# Altium schematic sheet [8] CONNECTORS MECH.SchDoc
size 431 x 279 mm; SheetNumber: 9; SheetTotal: 9
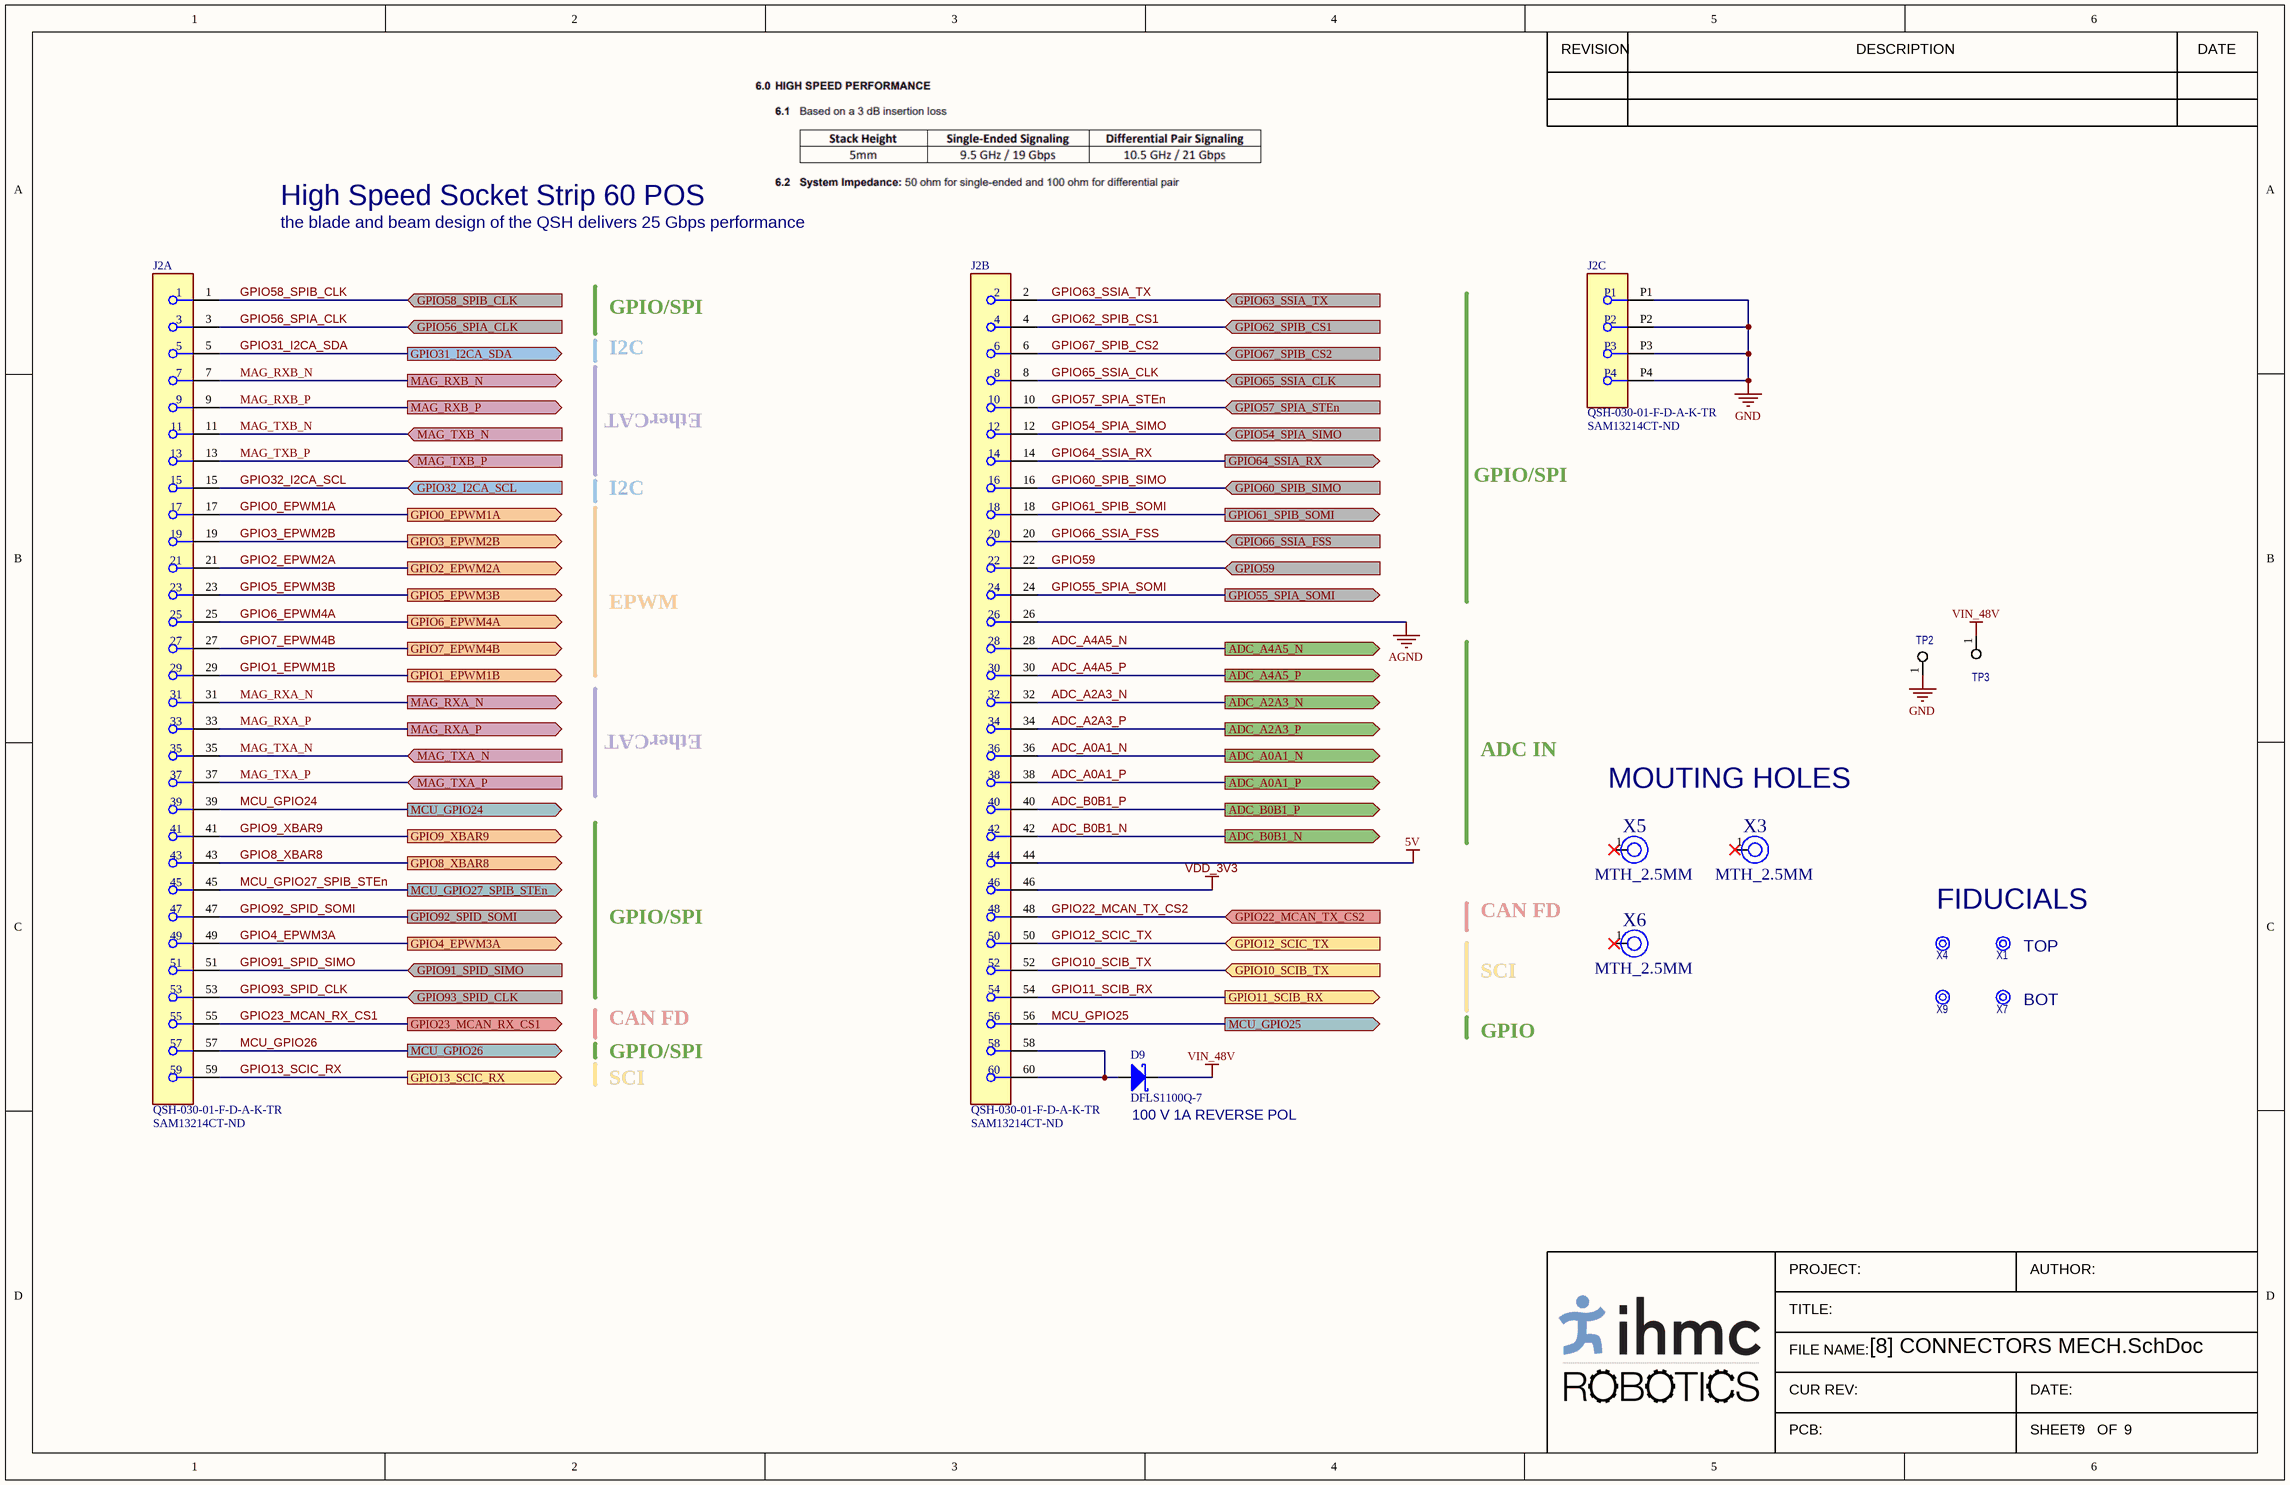
[diagram p0: [8] CONNECTORS MECH.SchDoc]

## Parts
D9  DFLS1100Q-7  [DI_123]
J2  QSH-030-01-F-D-A-K-TR  Supplier Part Number 1: SAM13214CT-ND  [FP-QSH-030-01-F-D-A-K-TR-MFG]  (parts A,B,C of 3)
TP2  TP_SMD  [TP_5019]  (value not drawn)  (no BOM)
TP3  TP_SMD  [TP_5019]  (value not drawn)  (no BOM)
X1  FIDUCIAL  [FIDUCIAL]  (value not drawn)  (no BOM)
X3  MTH_2.5MM  [MTH-M2.5mm]  (no BOM)
X4  FIDUCIAL  [FIDUCIAL]  (value not drawn)  (no BOM)
X5  MTH_2.5MM  [MTH-M2.5mm]  (no BOM)
X6  MTH_2.5MM  [MTH-M2.5mm]  (no BOM)
X7  FIDUCIAL  [FIDUCIAL]  (value not drawn)  (no BOM)
X9  FIDUCIAL  [FIDUCIAL]  (value not drawn)  (no BOM)

## Ports
ADC_A0A1_N (out), ADC_A0A1_P (out), ADC_A2A3_N (out), ADC_A2A3_P (out), ADC_A4A5_N (out), ADC_A4A5_P (out), ADC_B0B1_N (out), ADC_B0B1_P (out), GPIO0_EPWM1A (out), GPIO1_EPWM1B (out), GPIO2_EPWM2A (out), GPIO3_EPWM2B (out), GPIO4_EPWM3A (out), GPIO5_EPWM3B (out), GPIO6_EPWM4A (out), GPIO7_EPWM4B (out), GPIO8_XBAR8 (out), GPIO9_XBAR9 (out), GPIO10_SCIB_TX (in), GPIO11_SCIB_RX (out), GPIO12_SCIC_TX (in), GPIO13_SCIC_RX (out), GPIO22_MCAN_TX_CS2 (in), GPIO23_MCAN_RX_CS1 (out), GPIO31_I2CA_SDA (out), GPIO32_I2CA_SCL (in), GPIO54_SPIA_SIMO (in), GPIO55_SPIA_SOMI (out), GPIO56_SPIA_CLK (in), GPIO57_SPIA_STEn (in), GPIO58_SPIB_CLK (in), GPIO59 (in), GPIO60_SPIB_SIMO (in), GPIO61_SPIB_SOMI (out), GPIO62_SPIB_CS1 (in), GPIO63_SSIA_TX (in), GPIO64_SSIA_RX (out), GPIO65_SSIA_CLK (in), GPIO66_SSIA_FSS (in), GPIO67_SPIB_CS2 (in), GPIO91_SPID_SIMO (in), GPIO92_SPID_SOMI (out), GPIO93_SPID_CLK (in), MAG_RXA_N (out), MAG_RXA_P (out), MAG_RXB_N (out), MAG_RXB_P (out), MAG_TXA_N (in), MAG_TXA_P (in), MAG_TXB_N (in), MAG_TXB_P (in), MCU_GPIO24 (out), MCU_GPIO25 (out), MCU_GPIO26 (out), MCU_GPIO27_SPIB_STEn (out)

## Nets
5V: J2.44
AGND: J2.26
GND: J2.P1 J2.P2 J2.P3 J2.P4 TP2.1(IN)
VDD_3V3: J2.46
VIN_48V: D9.1(K) TP3.1(IN)
ADC_A0A1_N: J2.36 ; port ADC_A0A1_N
ADC_A0A1_P: J2.38 ; port ADC_A0A1_P
ADC_A2A3_N: J2.32 ; port ADC_A2A3_N
ADC_A2A3_P: J2.34 ; port ADC_A2A3_P
ADC_A4A5_N: J2.28 ; port ADC_A4A5_N
ADC_A4A5_P: J2.30 ; port ADC_A4A5_P
ADC_B0B1_N: J2.42 ; port ADC_B0B1_N
ADC_B0B1_P: J2.40 ; port ADC_B0B1_P
GPIO0_EPWM1A: J2.17 ; port GPIO0_EPWM1A
GPIO1_EPWM1B: J2.29 ; port GPIO1_EPWM1B
GPIO2_EPWM2A: J2.21 ; port GPIO2_EPWM2A
GPIO3_EPWM2B: J2.19 ; port GPIO3_EPWM2B
GPIO4_EPWM3A: J2.49 ; port GPIO4_EPWM3A
GPIO5_EPWM3B: J2.23 ; port GPIO5_EPWM3B
GPIO6_EPWM4A: J2.25 ; port GPIO6_EPWM4A
GPIO7_EPWM4B: J2.27 ; port GPIO7_EPWM4B
GPIO8_XBAR8: J2.43 ; port GPIO8_XBAR8
GPIO9_XBAR9: J2.41 ; port GPIO9_XBAR9
GPIO10_SCIB_TX: J2.52 ; port GPIO10_SCIB_TX
GPIO11_SCIB_RX: J2.54 ; port GPIO11_SCIB_RX
GPIO12_SCIC_TX: J2.50 ; port GPIO12_SCIC_TX
GPIO13_SCIC_RX: J2.59 ; port GPIO13_SCIC_RX
GPIO22_MCAN_TX_CS2: J2.48 ; port GPIO22_MCAN_TX_CS2
GPIO23_MCAN_RX_CS1: J2.55 ; port GPIO23_MCAN_RX_CS1
GPIO31_I2CA_SDA: J2.5 ; port GPIO31_I2CA_SDA
GPIO32_I2CA_SCL: J2.15 ; port GPIO32_I2CA_SCL
GPIO54_SPIA_SIMO: J2.12 ; port GPIO54_SPIA_SIMO
GPIO55_SPIA_SOMI: J2.24 ; port GPIO55_SPIA_SOMI
GPIO56_SPIA_CLK: J2.3 ; port GPIO56_SPIA_CLK
GPIO57_SPIA_STEn: J2.10 ; port GPIO57_SPIA_STEn
GPIO58_SPIB_CLK: J2.1 ; port GPIO58_SPIB_CLK
GPIO59: J2.22 ; port GPIO59
GPIO60_SPIB_SIMO: J2.16 ; port GPIO60_SPIB_SIMO
GPIO61_SPIB_SOMI: J2.18 ; port GPIO61_SPIB_SOMI
GPIO62_SPIB_CS1: J2.4 ; port GPIO62_SPIB_CS1
GPIO63_SSIA_TX: J2.2 ; port GPIO63_SSIA_TX
GPIO64_SSIA_RX: J2.14 ; port GPIO64_SSIA_RX
GPIO65_SSIA_CLK: J2.8 ; port GPIO65_SSIA_CLK
GPIO66_SSIA_FSS: J2.20 ; port GPIO66_SSIA_FSS
GPIO67_SPIB_CS2: J2.6 ; port GPIO67_SPIB_CS2
GPIO91_SPID_SIMO: J2.51 ; port GPIO91_SPID_SIMO
GPIO92_SPID_SOMI: J2.47 ; port GPIO92_SPID_SOMI
GPIO93_SPID_CLK: J2.53 ; port GPIO93_SPID_CLK
MAG_RXA_N: J2.31 ; port MAG_RXA_N
MAG_RXA_P: J2.33 ; port MAG_RXA_P
MAG_RXB_N: J2.7 ; port MAG_RXB_N
MAG_RXB_P: J2.9 ; port MAG_RXB_P
MAG_TXA_N: J2.35 ; port MAG_TXA_N
MAG_TXA_P: J2.37 ; port MAG_TXA_P
MAG_TXB_N: J2.11 ; port MAG_TXB_N
MAG_TXB_P: J2.13 ; port MAG_TXB_P
MCU_GPIO24: J2.39 ; port MCU_GPIO24
MCU_GPIO25: J2.56 ; port MCU_GPIO25
MCU_GPIO26: J2.57 ; port MCU_GPIO26
MCU_GPIO27_SPIB_STEn: J2.45 ; port MCU_GPIO27_SPIB_STEn
NetD9_2: D9.2(A) J2.58 J2.60

Not connected (* = marked no-connect by the designer): X3 1*; X5 1*; X6 1*

## Notes on the sheet
- High Speed Socket Strip 60 POS
- the blade and beam design of the QSH delivers 25 Gbps performance
- I2C
- GPIO/SPI
- EtherCAT
- EPWM
- ADC IN
- MOUTING HOLES
- CAN FD
- FIDUCIALS
- (near X1) TOP
- SCI
- (near X7) BOT
- GPIO
- (near D9) 100 V 1A REVERSE POL
- REVISION
- DESCRIPTION
- DATE
- PROJECT:
- AUTHOR:
- TITLE:
- FILE NAME:
- CUR REV:
- PCB:
- SHEET:
- DATE:
- OF

## Library data of the parts
D9 = DIODE_SCHOTTKY_100V_1A_DFLS1100Q-7: Rectifier Diode Schottky 100V 1A Automotive 2-Pin PowerDI 123 T/R; Manufacturer: Diodes; Supplier 1: Digi-Key; Manufacturer Part Number: DFLS1100Q-7; RoHS: Yes; Category: Rectifier Diodes; Stock 1: 12778; Pricing 1: 1=0.47000, 10=0.40100, 100=0.29960, 500=0.23540, 1000=0.18190 (USD); Mount: Surface Mount; Packaging: Tape and Reel; Average Rectified Current: 1A; Max Reverse Voltage (DC): 100V; RoHS Compliant: Yes; ComponentLink1URL: http://www.farnell.com/datasheets/2238295.pdf?src-supplier=Farnell; ComponentLink1Description: http://www.farnell.com/datasheets/2238295.pdf?src-supplier=Farnell; ComponentLink2URL: https://www.diodes.com/assets/Datasheets/ds30497.pdf?src-supplier=Digi-Key; ComponentLink2Description: https://www.diodes.com/assets/Datasheets/ds30497.pdf?src-supplier=Digi-Key; ComponentLink3URL: http://www.farnell.com/datasheets/2238295.pdf?src-supplier=Newark; ComponentLink3Description: http://www.farnell.com/datasheets/2238295.pdf?src-supplier=Newark; ComponentLink4URL: http://www.farnell.com/datasheets/2238295.pdf?src-supplier=Element14; ComponentLink4Description: http://www.farnell.com/datasheets/2238295.pdf?src-supplier=Element14; Supplier Part Number 1: DFLS1100Q-7DICT-ND
J2 = QSH-030-01-F-D-A_60PINS_CON: Conn Micro High Speed Socket Strip SKT 60 POS 0.5mm Solder ST SMD Automotive T/R; Manufacturer: Samtec; Voltage Rating (AC): 125V; Number of Contacts: 60; Gender: Female; Contact Plating: Gold; Pitch: 0.5mm; Housing Material: Polymer; Min Operating Temperature: -55°C; Termination: Solder; Radiation Hardening: No; Max Operating Temperature: 125°C; Length: 21.27mm; Depth: 7.49mm; Mount: Surface Mount; Max Voltage Rating (AC): 125V; Contact Material: Bronze; Lead Free: Lead Free; Orientation: Straight; Number of Rows: 2; Housing Color: Black; Packaging: Tape and Reel; Supplier 1: Digi-Key; Manufacturer Part Number: QSH-030-01-F-D-A-K-TR; RoHS: Yes; Category: Headers and Wire Housings; Stock 1: 520; Pricing 1: 1=9.59000, 10=9.17400, 25=8.34000, 50=7.92300, 100=7.71450, 250=6.88052 (USD); RoHS Compliant: Yes; ComponentLink1URL: https://datasheet.ciiva.com/9475/qsh-9475259.pdf?src-supplier=Avnet; ComponentLink1Description: https://datasheet.ciiva.com/9475/qsh-9475259.pdf?src-supplier=Avnet
TP2 TP3 = TP_SMD_1MM: Test point SMD
X3 X5 X6 = MTH_2.5MM: FORWARD_PCB: 1; STATUS: NOT INSTALLED; PKG_TYPE: MTH_2.5MM